# EAGLE design Burglar alarm (EAGLE 9.6.2)
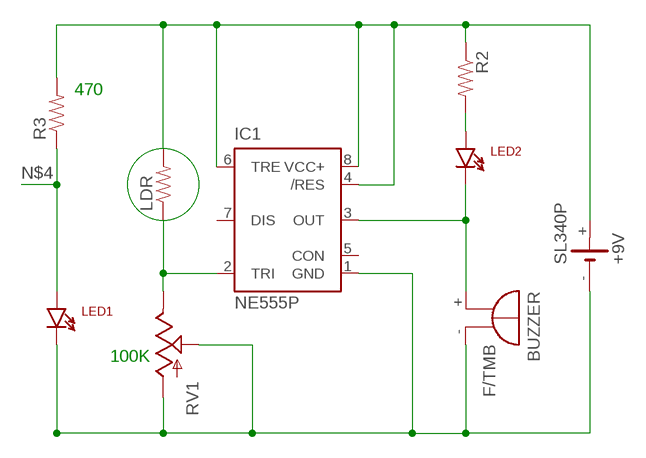
[diagram p0: schematic, sheet 1]

## Parts
+9V  SL340P  [SL-340/P3.6V]
BUZZER  F/TMB  [F/TMB]
IC1  NE555P  [DIL-08]
LDR  RESISTORAXIAL-0.3  [AXIAL-0.3]
LED1  LTE-302  [LTE-302]
LED2  LTE-302  [LTE-302]
R2  RESISTORAXIAL-0.3  [AXIAL-0.3]
R3  RESISTORAXIAL-0.3  [AXIAL-0.3]
RV1  POTTRIM  [TRIM_POT]

## Nets
N$1: IC1.2(TRI) LDR.P$1 RV1.2(E)
N$2: BUZZER.+ IC1.3(OUT) LED2.C
N$3: LED2.A R2.P$2
N$4: LED1.A R3.P$1
N$5: +9V.+ IC1.4(/RES) IC1.6(TRE) IC1.8(VCC+) LDR.P$2 R2.P$1 R3.P$2
N$6: +9V.- BUZZER.- IC1.1(GND) LED1.C RV1.1(S) RV1.3(A)
Unconnected: IC1.5(CON) IC1.7(DIS)

## Notes on the sheet
- 470
- 100K

## Library data of the parts
+9V = battery:SL340P: LI BATTERY Sonnenschein SL-340 P 3.6 V
BUZZER = buzzer:F/TMB: BUZZER Source: Buerklin; OC_FARNELL: unknown; OC_NEWARK: unknown
IC1 = SparkFun-AnalogIC:NE555: General purpose bipolar Timer; MF: Arrow Electronics; MPN: NE555N; OC_FARNELL: 1467742; OC_NEWARK: 89K1486
LDR R2 R3 = SparkFun-Passives:RESISTOR: Resistor Basic schematic elements and footprints for 0603, 1206, and PTH resistors.
LED1 LED2 = SparkFun-LED:LTE-302: Through-hole side-firing 940nm IR LED
RV1 = SparkFun-Retired:POT; PROD_ID: COM-00104

## Board
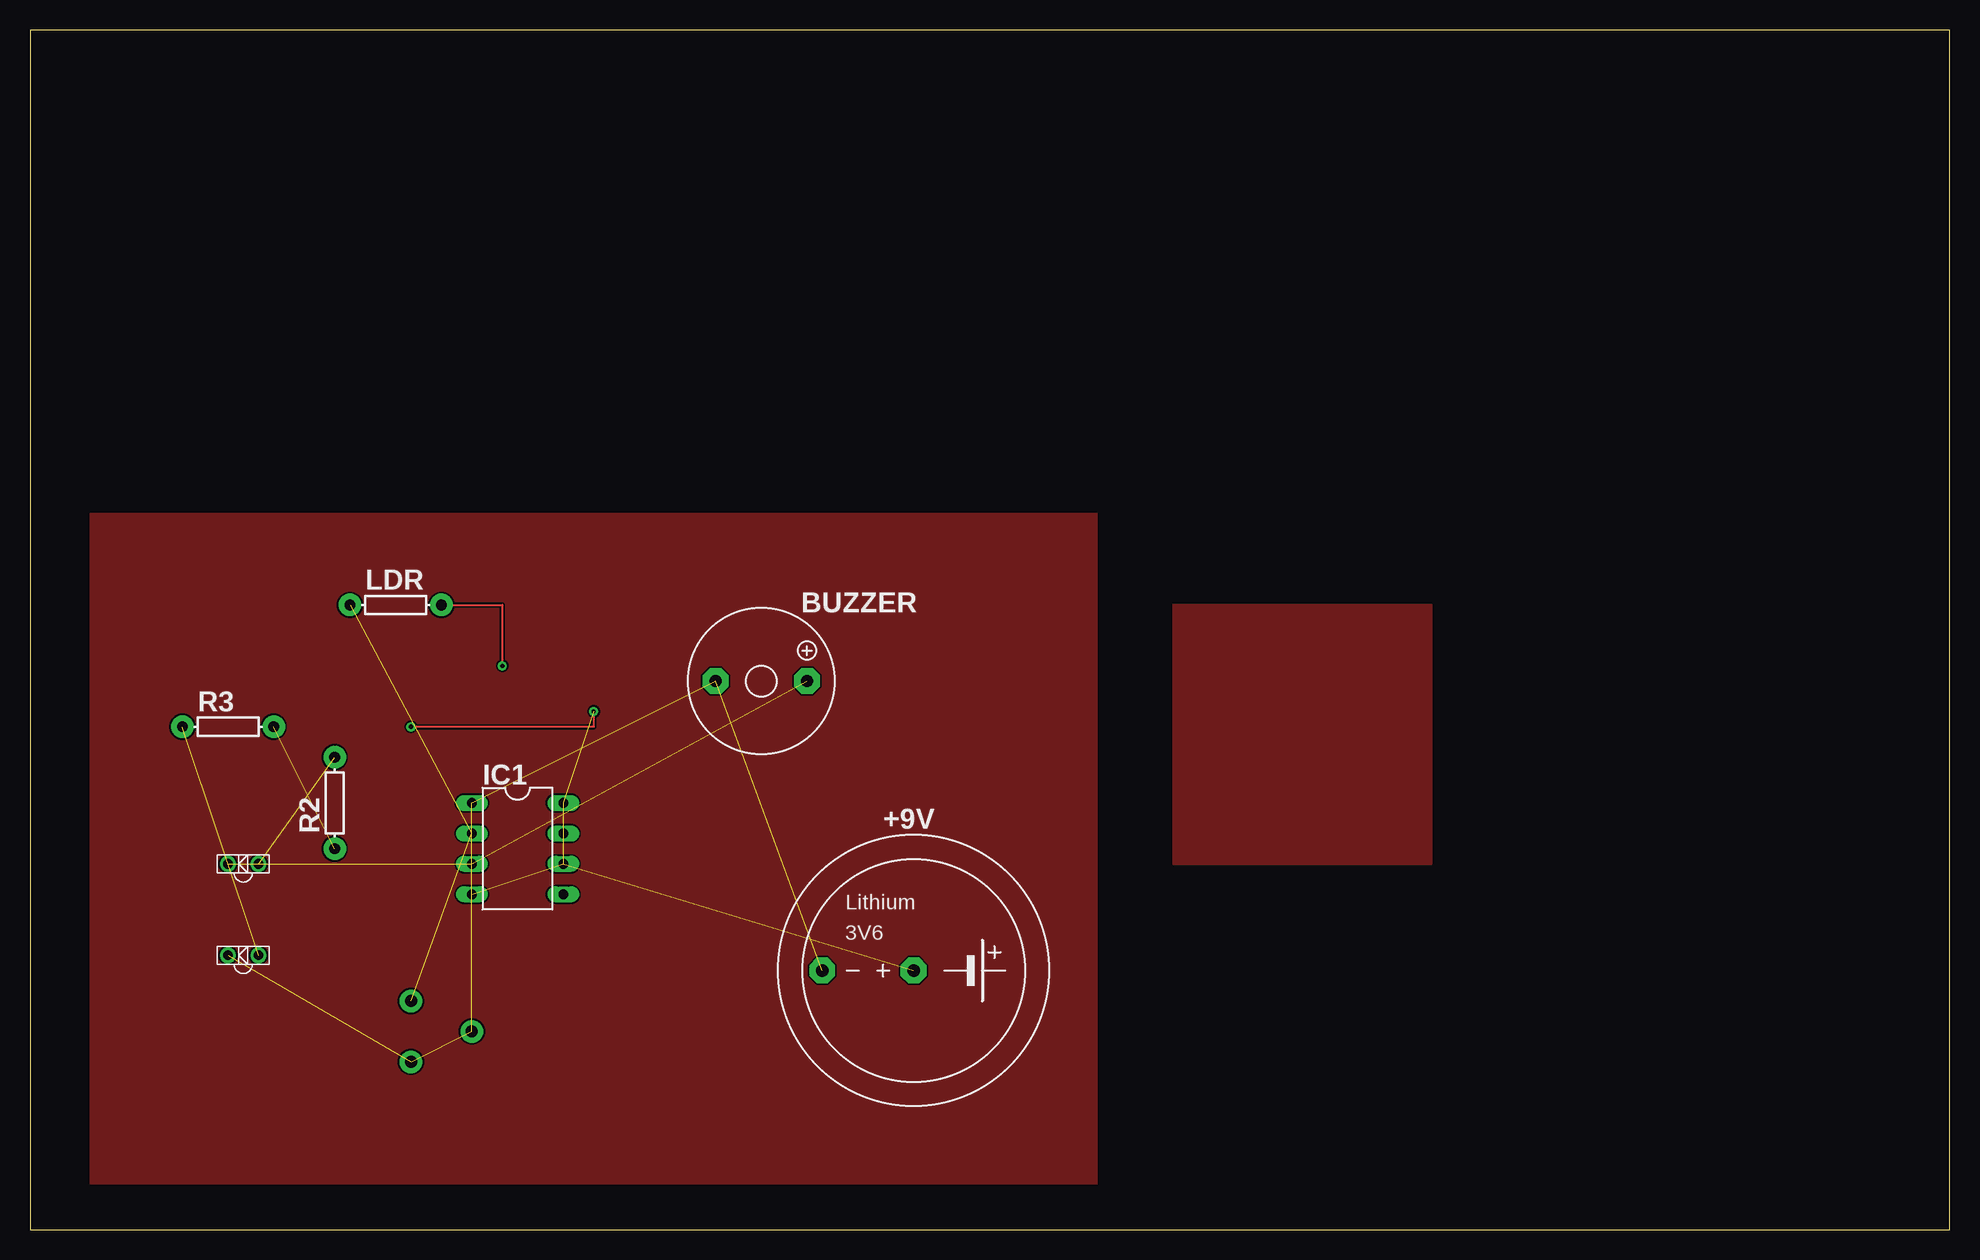
[diagram p1: board, top side]
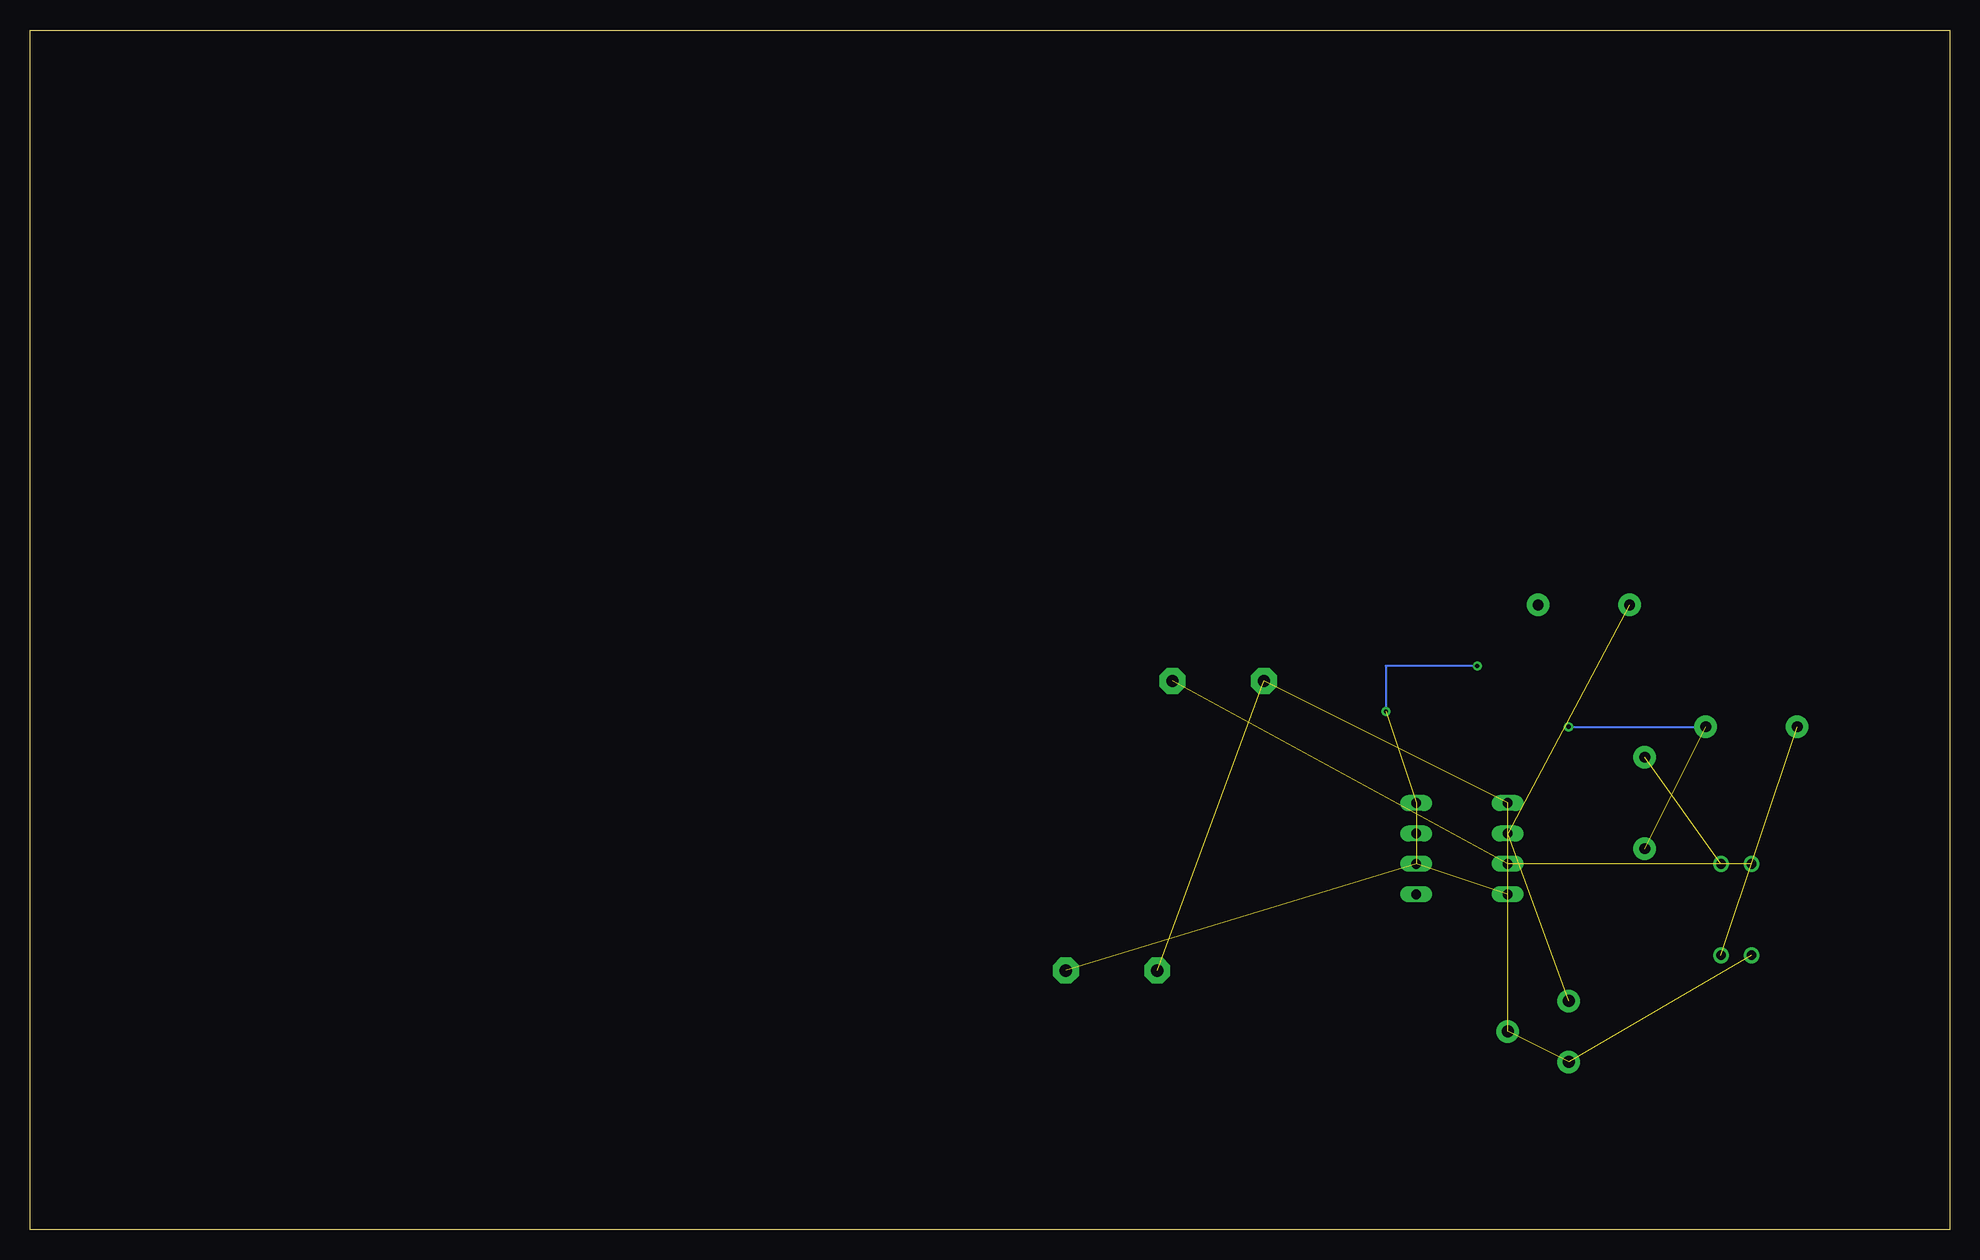
[diagram p2: board, bottom side, seen from below]

Size 160 x 100 mm. Coordinates in mm from the lower left corner, seen from the top.
Outline: 0,0 160,0 160,100 0,100 0,0
Copper layers (1*16): Top 0.035mm / dielectric 1.5mm / Bottom 0.035mm
Design rules "default": minimum track width 6mil, minimum drill 0.35mm, track to track 6mil, track to pad 6mil, pad to pad 6mil, via to via 6mil, smd to smd 6mil, copper to edge 40mil, drill to drill 6mil, minimum pad ring 10mil, minimum via ring 8mil, stop-mask expansion 4mil, vias tented up to drill 0mil, thermal gap 10mil

### Footprints (pad centres in the part's own frame; a part is rotated, then mirrored left to right if it is on the bottom)
SL-340/P3.6V = drill 1.016 pad 2.159 octagon: + 0,0; - -7.62,0
F/TMB = drill 1.016 pad 2.159 octagon: + 3.81,0; - -3.81,0
DIL-08 = drill 0.813 long: 1 -3.81,-3.81; 2 -1.27,-3.81; 3 1.27,-3.81; 4 3.81,-3.81; 5 3.81,3.81; 6 1.27,3.81; 7 -1.27,3.81; 8 -3.81,3.81
AXIAL-0.3 = drill 0.9 pad 1.88: P$1 -3.81,0; P$2 3.81,0
LTE-302 = drill 0.8: A 1.27,0; C -1.27,0
TRIM_POT = drill 1 pad 1.88: 1 5.08,0; 2 0,2.54; 3 0,-2.54

### Placement (x,y rotation side)
+9V  73.66,21.59 0 top
BUZZER  60.96,45.72 0 top
IC1  40.64,31.75 270 top
LDR  30.48,52.07 0 top
LED1  17.78,22.86 0 top
LED2  17.78,30.48 0 top
R2  25.4,35.56 90 top
R3  16.51,41.91 0 top
RV1  31.75,16.51 0 top

### Tracks (layer width: path | path; a pad name or v marks a point on that pad's centre or on a via)
GND
  pour Top: 5.08,59.69 88.9,59.69 88.9,3.81 5.08,3.81
N$1  (2 unrouted)
N$2  (2 unrouted)
N$3  (1 unrouted)
N$4  (1 unrouted)
N$5  (via drill 0.35)  (5 unrouted)
  Top 0.152: LDR.P$2 39.37,52.07 v39.37,46.99 | v46.99,43.18 46.99,41.91 v31.75,41.91
  Bottom 0.152: v39.37,46.99 46.99,46.99 v46.99,43.18 | v31.75,41.91 R3.P$2
N$6  (5 unrouted)
PWD
  pour Top: 95.25,30.48 116.84,30.48 116.84,52.07 95.25,52.07